# Altium project esp32final.PrjPcb
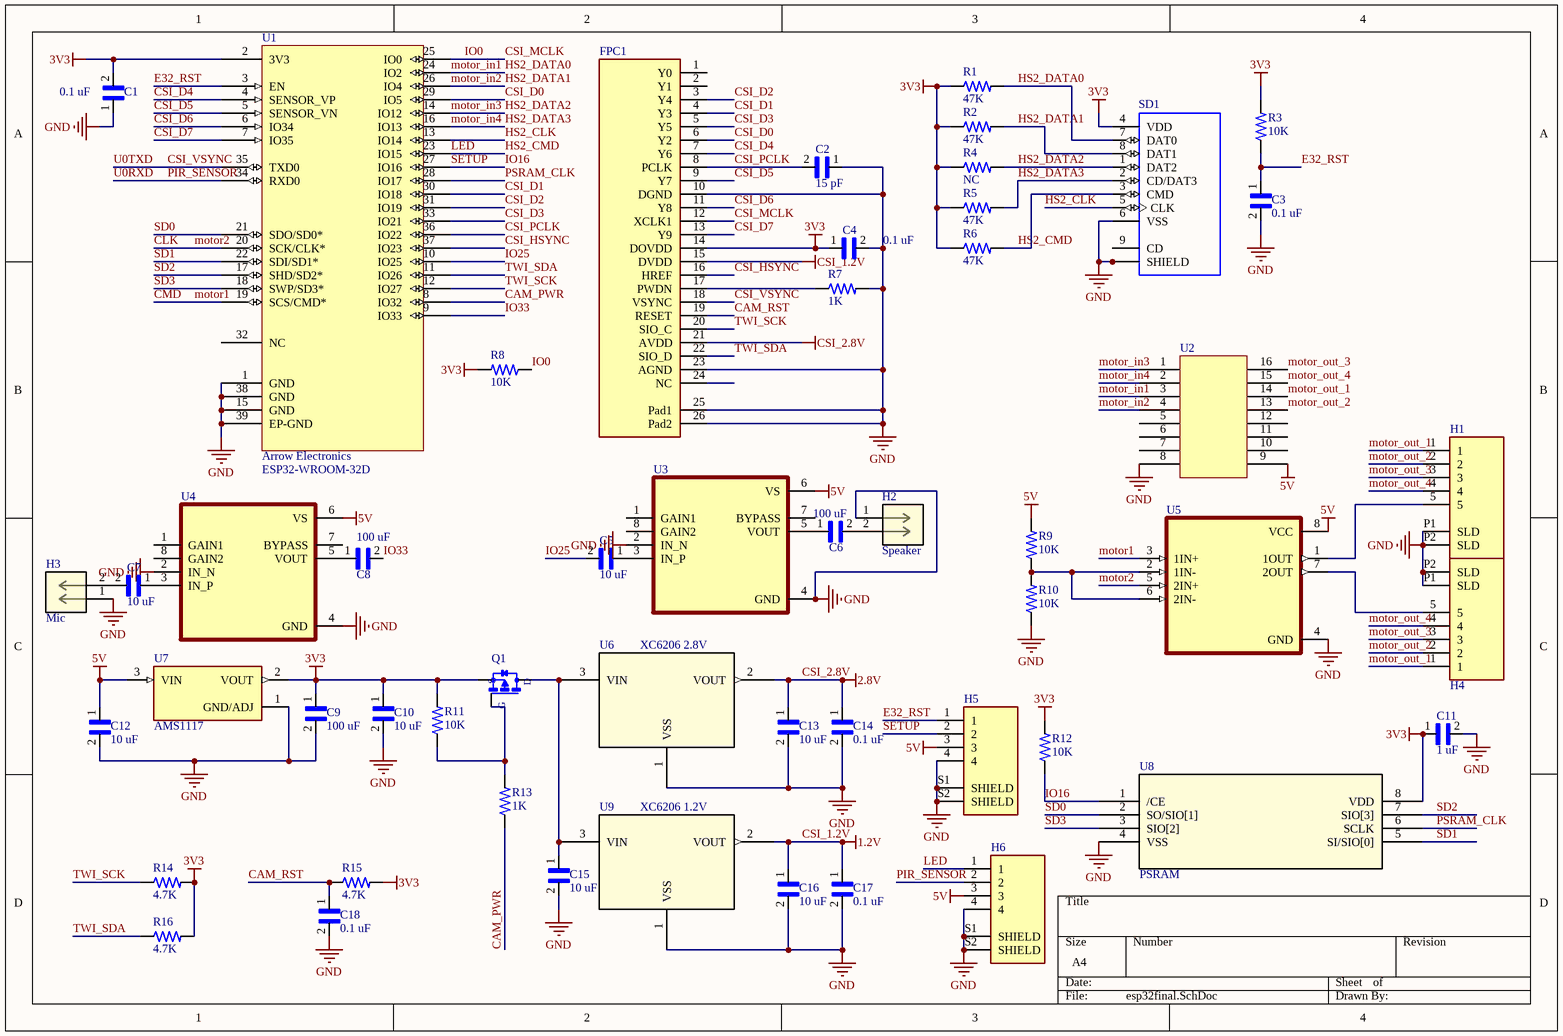
[diagram p0: esp32final.SchDoc]
1 sheet, 52 parts. Net scope: global (net labels, ports and power ports of the same name join across sheets).
Board file: esp32final.PcbDoc

## Sheet esp32final.SchDoc
size A4; SheetNumber: 1; SheetTotal: 1

### Parts
C1  0.1 uF  [CAP 0402]
C2  15 pF  [CAP 0603]
C3  0.1 uF  [CAP 0402]
C4  0.1 uF  [CAP 0402]
C5  10 uF  [CAP 0603]
C6  100 uF  [Tantalum CAP]
C7  10 uF  [CAP 0603]
C8  100 uF  [Tantalum CAP]
C9  100 uF  [Tantalum CAP]
C10  10 uF  [CAP 0603]
C11  1 uF  [CAP 0402]
C12  10 uF  [CAP 0603]
C13  10 uF  [CAP 0603]
C14  0.1 uF  [CAP 0402]
C15  10 uF  [CAP 0603]
C16  10 uF  [CAP 0603]
C17  0.1 uF  [CAP 0402]
C18  0.1 uF  [CAP 0402]
FPC1  FPC Connector 26 Pins  [FPC Connector 26 Pins]  (value not drawn)
H1  Header 5P 1mm  [Header 5P 1mm]  (value not drawn)
H2  Speaker  [Header 2P 1MM]
H3  Mic  [Header 2P 1MM]
H4  Header 5P 1mm  [Header 5P 1mm]  (value not drawn)
H5  Header 4P 1mm  [Header 4P 1mm]  (value not drawn)
H6  Header 4P 1mm  [Header 4P 1mm]  (value not drawn)
Q1  P-MOS SOT-23-3  [P-MOS SOT-23-3]  (value not drawn)
R1  47K  [RES 0402]
R2  47K  [RES 0402]
R3  10K  [RES 0402]
R4  NC  [RES 0402]
R5  47K  [RES 0402]
R6  47K  [RES 0402]
R7  1K  [RES 0402]
R8  10K  [RES 0402]
R9  10K  [RES 0402]
R10  10K  [RES 0402]
R11  10K  [RES 0402]
R12  10K  [RES 0402]
R13  1K  [RES 0402]
R14  4.7K  [RES 0402]
R15  4.7K  [RES 0402]
R16  4.7K  [RES 0402]
SD1  Micro SD TF  [Micro SD TF]  (value not drawn)
U1  Supplier 1: Arrow Electronics  [ESP32-WROOM-32D]  (hidden comment: ESP32-WROOM-32D)
U2  ULN 2003A  [ULN 2003A]  (value not drawn)
U3  LM386  [PCBC_LM386]  (value not drawn)
U4  LM386  [PCBC_LM386]  (value not drawn)
U5  LM 393 SOIC-8  [LM 393 SOIC-8]  (value not drawn)
U6  XC6206 2.8V  [XC6206 2.8V]
U7  AMS1117  [AMS1117]
U8  PSRAM  [PSRAM]
U9  XC6206 1.2V  [XC6206 1.2V]

### Nets
3V3: C1.2 C4.1 C9.1 C10.1 C11.1 FPC1.14(DOVDD) Q1.2(S) R1.1 R2.1 R3.2 R4.1 R5.1 R6.1 R8.2 R11.2 R12.2 R14.2 R15.2 R16.2 SD1.4(VDD) U1.2(3V3) U7.2(VOUT) U8.8(VDD)
5V: C12.1 H5.3 H6.3 R9.2 U2.9(DIOTS) U3.6(VS) U4.6(VS) U5.8(VCC) U7.3(VIN)
CSI_1.2V: C16.1 C17.1 FPC1.15(DVDD) U9.2(VOUT)  [also labelled 1.2V]
CSI_2.8V: C13.1 C14.1 FPC1.21(AVDD) U6.2(VOUT)  [also labelled 2.8V]
GND: C1.1 C2.1 C3.2 C4.2 C9.2 C10.2 C11.2 C12.2 C13.2 C14.2 C15.2 C16.2 C17.2 C18.2 FPC1.10(DGND) FPC1.23(AGND) FPC1.25(Pad1) FPC1.26(Pad2) H1.P1(SLD) H1.P2(SLD) H2.1 H3.1 H4.P1(SLD) H4.P2(SLD) H5.4 H5.S1(SHIELD) H5.S2(SHIELD) H6.4 H6.S1(SHIELD) H6.S2(SHIELD) R7.2 R10.1 SD1.6(VSS) SD1.10(SHIELD) SD1.11(SHIELD) SD1.12(SHIELD) SD1.13(SHIELD) U1.1(GND) U1.15(GND) U1.38(GND) U1.39(EP-GND) U2.8(GND) U3.2(IN_N) U3.4(GND) U4.2(IN_N) U4.4(GND) U5.4(GND) U6.1(VSS) U7.1(GND/ADJ) U8.4(VSS) U9.1(VSS)
CAM_PWR: R13.1 U1.8(IO32)
CAM_RST: C18.1 FPC1.19(RESET) R15.1
CLK: U1.20(SCK/CLK*) U5.5(2IN+)  [also labelled motor2]
CMD: U1.19(SCS/CMD*) U5.3(1IN+)  [also labelled motor1]
CSI_D0: FPC1.6(Y2) U1.29(IO5)
CSI_D1: FPC1.4(Y3) U1.30(IO18)
CSI_D2: FPC1.3(Y4) U1.31(IO19)
CSI_D3: FPC1.5(Y5) U1.33(IO21)
CSI_D4: FPC1.7(Y6) U1.4(SENSOR_VP)
CSI_D5: FPC1.9(Y7) U1.5(SENSOR_VN)
CSI_D6: FPC1.11(Y8) U1.6(IO34)
CSI_D7: FPC1.13(Y9) U1.7(IO35)
CSI_HSYNC: FPC1.16(HREF) U1.37(IO23)
CSI_MCLK: FPC1.12(XCLK1) R8.1 U1.25(IO0)  [also labelled IO0]
CSI_PCLK: C2.2 FPC1.8(PCLK) U1.36(IO22)
CSI_VSYNC: FPC1.18(VSYNC) U1.35(TXD0)  [also labelled U0TXD]
E32_RST: C3.1 H5.1 R3.1 U1.3(EN)
HS2_CLK: SD1.5(CLK) U1.13(IO14)
HS2_CMD: H6.1 R6.2 SD1.3(CMD) U1.23(IO15)  [also labelled LED]
HS2_DATA0: R1.2 SD1.7(DAT0) U1.24(IO2) U2.3(IN3)  [also labelled motor_in1]
HS2_DATA1: R2.2 SD1.8(DAT1) U1.26(IO4) U2.4(IN4)  [also labelled motor_in2]
HS2_DATA2: R4.2 SD1.1(DAT2) U1.14(IO12) U2.1(IN1)  [also labelled motor_in3]
HS2_DATA3: R5.2 SD1.2(CD/DAT3) U1.16(IO13) U2.2(IN2)  [also labelled motor_in4]
IO16: H5.2 R12.1 U1.27(IO16) U8.1(/CE)  [also labelled SETUP]
IO25: C5.2 U1.10(IO25)
IO33: C8.2 U1.9(IO33)
motor_out_1: H1.1 H4.1 U2.14(OUT3)
motor_out_2: H1.2 H4.2 U2.13(OUT4)
motor_out_3: H1.3 H4.3 U2.16(OUT1)
motor_out_4: H1.4 H4.4 U2.15(OUT2)
PIR_SENSOR: H6.2 U1.34(RXD0)  [also labelled U0RXD]
PSRAM_CLK: U1.28(IO17) U8.6(SCLK)
SD0: U1.21(SDO/SD0*) U8.2(SO/SIO[1])
SD1: U1.22(SDI/SD1*) U8.5(SI/SIO[0])
SD2: U1.17(SHD/SD2*) U8.7(SIO[3])
SD3: U1.18(SWP/SD3*) U8.3(SIO[2])
TWI_SCK: FPC1.20(SIO_C) R14.1 U1.12(IO27)
TWI_SDA: FPC1.22(SIO_D) R16.1 U1.11(IO26)
NetC5_1: C5.1 U3.3(IN_P)
NetC6_1: C6.1 U3.5(VOUT)
NetC6_2: C6.2 H2.2
NetC7_1: C7.1 U4.3(IN_P)
NetC7_2: C7.2 H3.2
NetC8_1: C8.1 U4.5(VOUT)
NetC15_1: C15.1 Q1.3(D) U6.3(VIN) U9.3(VIN)
NetFPC1_17: FPC1.17(PWDN) R7.1
NetH1_5: H1.5 U5.1(1OUT)
NetH4_5: H4.5 U5.7(2OUT)
NetQ1_1: Q1.1(G) R11.1 R13.2
NetR9_1: R9.1 R10.2 U5.2(1IN-) U5.6(2IN-)

Not connected (* = marked no-connect by the designer): FPC1 1(Y0) 2(Y1) 24(NC); SD1 9(CD); U1 32(NC); U2 5(IN5) 6(IN6) 7(IN7) 10(OUT7) 11(OUT6) 12(OUT5); U3 1(GAIN1) 7(BYPASS) 8(GAIN2); U4 1(GAIN1) 7(BYPASS) 8(GAIN2)

### Library data of the parts
C1 C3 C4 C11 C14 C17 C18 = CAP 0402: GCM155R71E333JA55D
C2 C5 C7 C10 C12 C13 C15 C16 = CAP 0603: LD033C471KAB2A
C6 C8 = Tantalum CAP: SMD-2
C9 = Tantalum CAP
H1 H4 = Header 5P 1mm: BM05B-SRSS-TB(LF)(SN)
H2 H3 = Header 2P 1mm: BM02B-SRSS-TB (LF)(SN)
H5 H6 = Header 4P 1mm: BM04B-SRSS-TB(LF)(SN)
Q1 = P-MOS SOT-23-3: FDN352AP
R1-R16 = RES 0402
SD1 = Micro SD TF: MEM2051-00-195-00-A
U3 U4 = LM386: LM386M-1/NOPB. Wide Input Voltage Low Power Audio Amplifier with Internal Gain 8-SOIC 0 to 70; Supplier 1: Mouser; Supplier Part Number 1: 926-LM386M-1/NOPB
U5 = LM 393 SOIC-8: LM393DR
U6 = XC6206 2.8V: XC6206P282MR-G; Supplier 1: Newark
U9 = XC6206 1.2V: XC6206P122MR-G
U1 = ESP32-WROOM-32D: ComponentLink1Description: New link; ComponentLink1URL: *; ComponentLink2Description: New link; ComponentLink2URL: *; Supplier Part Number 1: ESP32-WROOM-32D